# EAGLE design expander (EAGLE 7.2.0)
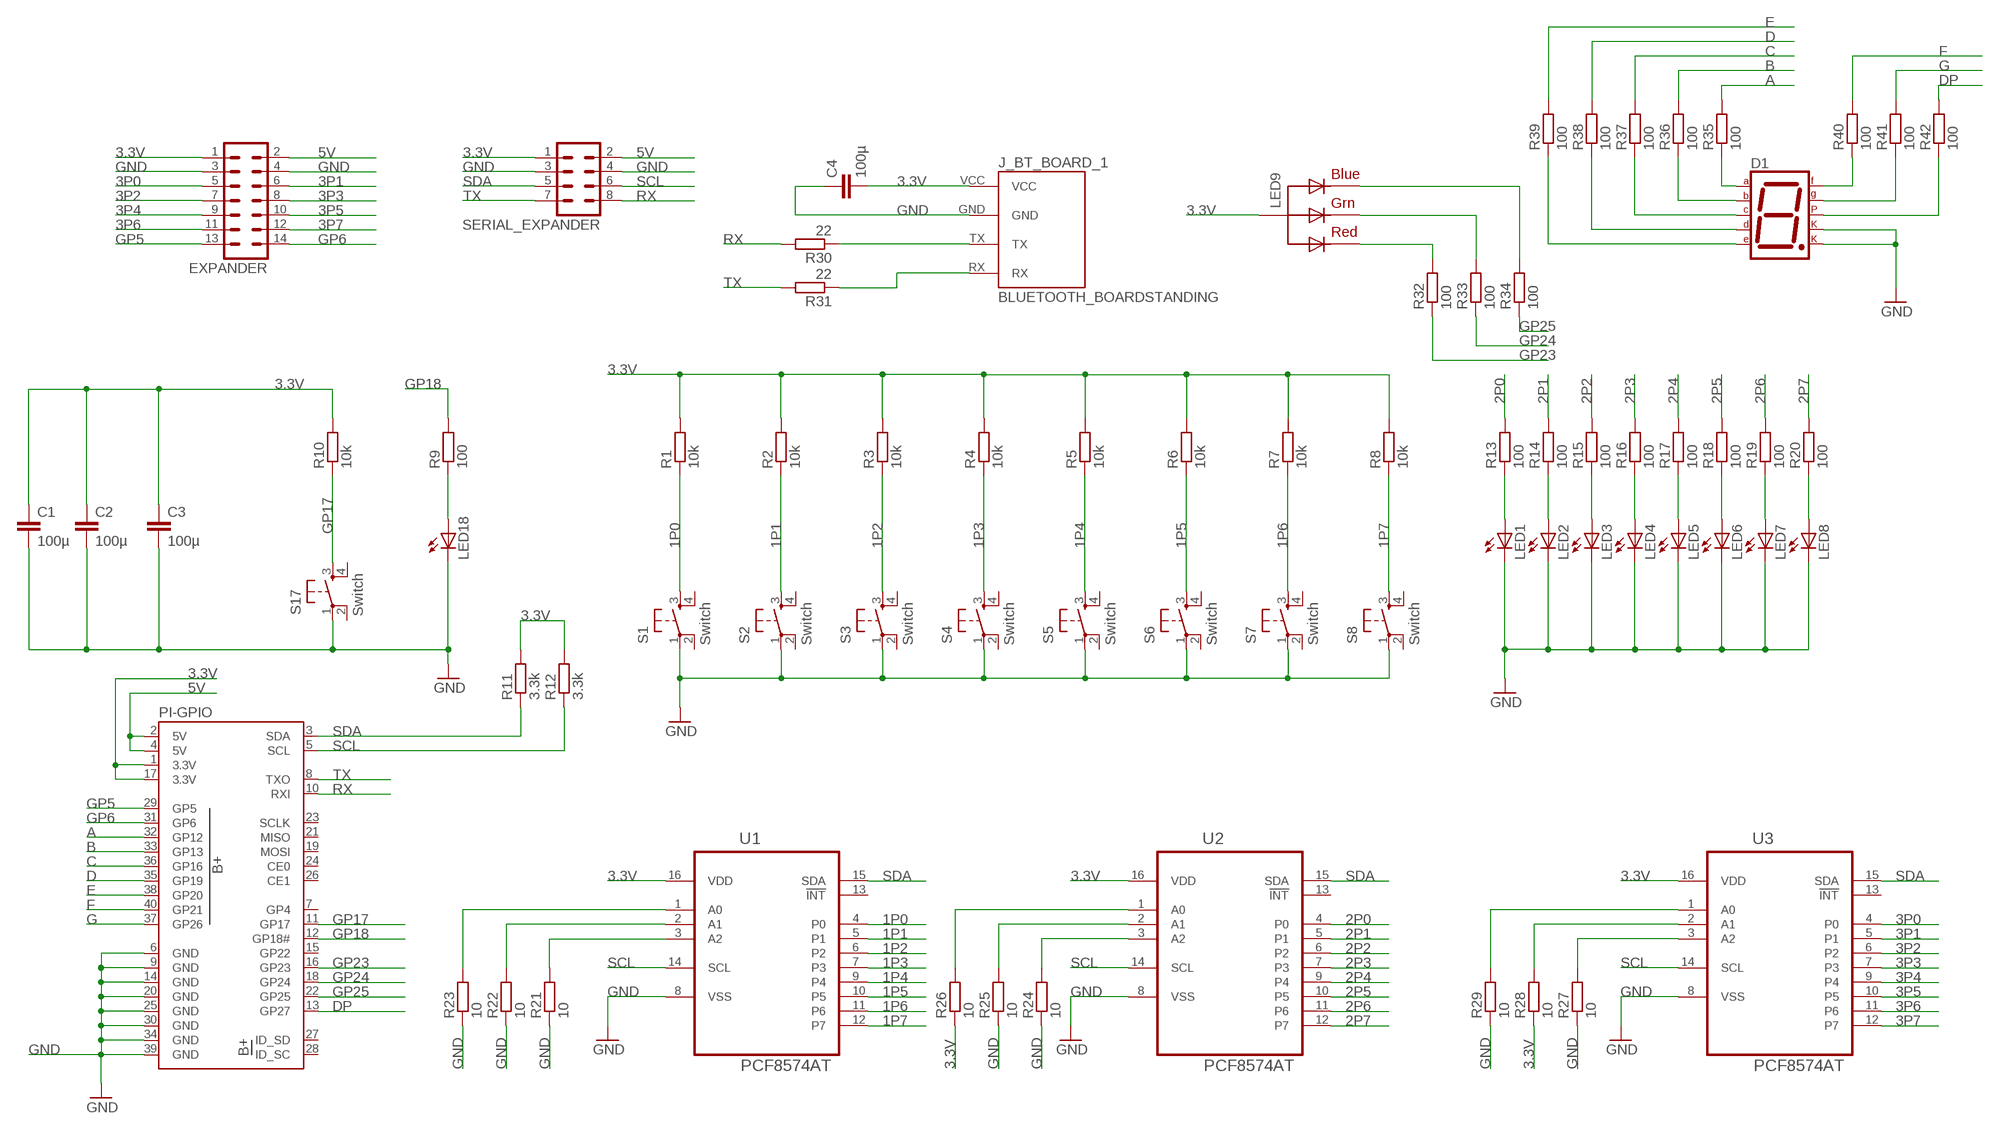
[diagram p0: schematic, sheet 1]

## Parts
C1  100µ  C-EUC0805  [C0805]
C2  100µ  C-EUC0805  [C0805]
C3  100µ  C-EUC0805  [C0805]
C4  100µ  C-EUC0805  [C0805]
D1  7SEG-CK  [7SEG-13]
EXPANDER  MA07-2  [MA07-2]
J_BT_BOARD_1  BLUETOOTH_BOARDSTANDING  [BT_BOARD_FOOTPRINT_STANDING]
LED1  LEDCHIP-LED0805  [CHIP-LED0805]
LED2  LEDCHIP-LED0805  [CHIP-LED0805]
LED3  LEDCHIP-LED0805  [CHIP-LED0805]
LED4  LEDCHIP-LED0805  [CHIP-LED0805]
LED5  LEDCHIP-LED0805  [CHIP-LED0805]
LED6  LEDCHIP-LED0805  [CHIP-LED0805]
LED7  LEDCHIP-LED0805  [CHIP-LED0805]
LED8  LEDCHIP-LED0805  [CHIP-LED0805]
LED9  RGBLED_CA-5MM  [LED5MMRGB]
LED18  LEDCHIP-LED0805  [CHIP-LED0805]
PI-GPIO  RASPBERRYPI-B+-GPIO  [2X20-SHROUDED]
R1  10k  R-EU_R0805  [R0805]
R2  10k  R-EU_R0805  [R0805]
R3  10k  R-EU_R0805  [R0805]
R4  10k  R-EU_R0805  [R0805]
R5  10k  R-EU_R0805  [R0805]
R6  10k  R-EU_R0805  [R0805]
R7  10k  R-EU_R0805  [R0805]
R8  10k  R-EU_R0805  [R0805]
R9  100  R-EU_R0805  [R0805]
R10  10k  R-EU_R0805  [R0805]
R11  3.3k  R-EU_R0805  [R0805]
R12  3.3k  R-EU_R0805  [R0805]
R13  100  R-EU_R0805  [R0805]
R14  100  R-EU_R0805  [R0805]
R15  100  R-EU_R0805  [R0805]
R16  100  R-EU_R0805  [R0805]
R17  100  R-EU_R0805  [R0805]
R18  100  R-EU_R0805  [R0805]
R19  100  R-EU_R0805  [R0805]
R20  100  R-EU_R0805  [R0805]
R21  10  R-EU_R0805  [R0805]
R22  10  R-EU_R0805  [R0805]
R23  10  R-EU_R0805  [R0805]
R24  10  R-EU_R0805  [R0805]
R25  10  R-EU_R0805  [R0805]
R26  10  R-EU_R0805  [R0805]
R27  10  R-EU_R0805  [R0805]
R28  10  R-EU_R0805  [R0805]
R29  10  R-EU_R0805  [R0805]
R30  22  R-EU_R0805  [R0805]
R31  22  R-EU_R0805  [R0805]
R32  100  R-EU_R0805  [R0805]
R33  100  R-EU_R0805  [R0805]
R34  100  R-EU_R0805  [R0805]
R35  100  R-EU_R0805  [R0805]
R36  100  R-EU_R0805  [R0805]
R37  100  R-EU_R0805  [R0805]
R38  100  R-EU_R0805  [R0805]
R39  100  R-EU_R0805  [R0805]
R40  100  R-EU_R0805  [R0805]
R41  100  R-EU_R0805  [R0805]
R42  100  R-EU_R0805  [R0805]
S1  Switch  TACTILE-SWITCH-PTH  [TAC-SWITCH-PTH]
S2  Switch  TACTILE-SWITCH-PTH  [TAC-SWITCH-PTH]
S3  Switch  TACTILE-SWITCH-PTH  [TAC-SWITCH-PTH]
S4  Switch  TACTILE-SWITCH-PTH  [TAC-SWITCH-PTH]
S5  Switch  TACTILE-SWITCH-PTH  [TAC-SWITCH-PTH]
S6  Switch  TACTILE-SWITCH-PTH  [TAC-SWITCH-PTH]
S7  Switch  TACTILE-SWITCH-PTH  [TAC-SWITCH-PTH]
S8  Switch  TACTILE-SWITCH-PTH  [TAC-SWITCH-PTH]
S17  Switch  TACTILE-SWITCH-PTH  [TAC-SWITCH-PTH]
SERIAL_EXPANDER  MA04-2  [MA04-2]
U1  PCF8574AT  PCF8574AT/3,512  [SOIC127P1032X265-16N]
U2  PCF8574AT  PCF8574AT/3,512  [SOIC127P1032X265-16N]
U3  PCF8574AT  PCF8574AT/3,512  [SOIC127P1032X265-16N]

## Nets
1P0: R1.1 S1.3 U1.4(P0)
1P1: R2.1 S2.3 U1.5(P1)
1P2: R3.1 S3.3 U1.6(P2)
1P3: R4.1 S4.3 U1.7(P3)
1P4: R5.1 S5.3 U1.9(P4)
1P5: R6.1 S6.3 U1.10(P5)
1P6: R7.1 S7.3 U1.11(P6)
1P7: R8.1 S8.3 U1.12(P7)
2P0: R13.2 U2.4(P0)
2P1: R14.2 U2.5(P1)
2P2: R15.2 U2.6(P2)
2P3: R16.2 U2.7(P3)
2P4: R17.2 U2.9(P4)
2P5: R18.2 U2.10(P5)
2P6: R19.2 U2.11(P6)
2P7: R20.2 U2.12(P7)
3.3V: C1.1 C2.1 C3.1 C4.2 EXPANDER.1 J_BT_BOARD_1.VCC LED9.2(VCC) PI-GPIO.1(3.3V) PI-GPIO.17(3.3V) R1.2 R2.2 R3.2 R4.2 R5.2 R6.2 R7.2 R8.2 R10.2 R11.2 R12.2 R26.1 R28.1 SERIAL_EXPANDER.1 U1.16(VDD) U2.16(VDD) U3.16(VDD)
3P0: EXPANDER.5 U3.4(P0)
3P1: EXPANDER.6 U3.5(P1)
3P2: EXPANDER.7 U3.6(P2)
3P3: EXPANDER.8 U3.7(P3)
3P4: EXPANDER.9 U3.9(P4)
3P5: EXPANDER.10 U3.10(P5)
3P6: EXPANDER.11 U3.11(P6)
3P7: EXPANDER.12 U3.12(P7)
5V: EXPANDER.2 PI-GPIO.2(5V) PI-GPIO.4(5V) SERIAL_EXPANDER.2
A: PI-GPIO.32(GP12) R35.2
B: PI-GPIO.33(GP13) R36.2
C: PI-GPIO.36(GP16) R37.2
D: PI-GPIO.35(GP19) R38.2
DP: PI-GPIO.13(GP27) R42.2
E: PI-GPIO.38(GP20) R39.2
F: PI-GPIO.40(GP21) R40.2
G: PI-GPIO.37(GP26) R41.2
GND: C1.2 C2.2 C3.2 C4.1 D1.3(CK1) D1.8(CK2) EXPANDER.3 EXPANDER.4 J_BT_BOARD_1.GND LED1.C LED2.C LED3.C LED4.C LED5.C LED6.C LED7.C LED8.C LED18.C PI-GPIO.6(GND) PI-GPIO.9(GND) PI-GPIO.14(GND) PI-GPIO.20(GND) PI-GPIO.25(GND) PI-GPIO.30(GND) PI-GPIO.34(GND) PI-GPIO.39(GND) R21.1 R22.1 R23.1 R24.1 R25.1 R27.1 R29.1 S1.1 S2.1 S3.1 S4.1 S5.1 S6.1 S7.1 S8.1 S17.1 SERIAL_EXPANDER.3 SERIAL_EXPANDER.4 U1.8(VSS) U2.8(VSS) U3.8(VSS)
GP5: EXPANDER.13 PI-GPIO.29(GP5)
GP6: EXPANDER.14 PI-GPIO.31(GP6)
GP17: PI-GPIO.11(GP17) R10.1 S17.3
GP18: PI-GPIO.12(GP18#) R9.2
GP23: PI-GPIO.16(GP23) R32.1
GP24: PI-GPIO.18(GP24) R33.1
GP25: PI-GPIO.22(GP25) R34.1
N$1: LED18.A R9.1
N$2: LED1.A R13.1
N$3: LED2.A R14.1
N$4: LED3.A R15.1
N$5: LED4.A R16.1
N$6: LED5.A R17.1
N$7: LED6.A R18.1
N$8: LED7.A R19.1
N$9: LED8.A R20.1
N$10: R21.2 U1.3(A2)
N$11: R22.2 U1.2(A1)
N$12: R23.2 U1.1(A0)
N$13: R24.2 U2.3(A2)
N$14: R25.2 U2.2(A1)
N$15: R26.2 U2.1(A0)
N$16: R27.2 U3.3(A2)
N$17: R28.2 U3.2(A1)
N$18: R29.2 U3.1(A0)
N$19: LED9.4(BLUE) R34.2
N$20: LED9.3(GREEN) R33.2
N$21: J_BT_BOARD_1.TX R30.1
N$22: J_BT_BOARD_1.RX R31.1
N$25: LED9.1(RED) R32.2
N$26: D1.7(A) R35.1
N$27: D1.6(B) R36.1
N$28: D1.4(C) R37.1
N$29: D1.2(D) R38.1
N$30: D1.1(E) R39.1
N$31: D1.9(F) R40.1
N$32: D1.10(G) R41.1
N$33: D1.5(DP) R42.1
RX: PI-GPIO.10(RXI) R30.2 SERIAL_EXPANDER.8
SCL: PI-GPIO.5(SCL) R12.1 SERIAL_EXPANDER.6 U1.14(SCL) U2.14(SCL) U3.14(SCL)
SDA: PI-GPIO.3(SDA) R11.1 SERIAL_EXPANDER.5 U1.15(SDA) U2.15(SDA) U3.15(SDA)
TX: PI-GPIO.8(TXO) R31.2 SERIAL_EXPANDER.7
Unconnected: PI-GPIO.7(GP4) PI-GPIO.15(GP22) PI-GPIO.19(MOSI) PI-GPIO.21(MISO) PI-GPIO.23(SCLK) PI-GPIO.24(CE0) PI-GPIO.26(CE1) PI-GPIO.27(ID_SD) PI-GPIO.28(ID_SC) S1.2 S1.4 S2.2 S2.4 S3.2 S3.4 S4.2 S4.4 S5.2 S5.4 S6.2 S6.4 S7.2 S7.4 S8.2 S8.4 S17.2 S17.4 U1.13(!INT) U2.13(!INT) U3.13(!INT)

## Library data of the parts
C1-C4 = rcl:C-EU: CAPACITOR, European symbol
D1 = special:7SEG-CK: 7-segment DISPLAY single cathode, 13 mm
EXPANDER = con-lstb:MA07-2: PIN HEADER; OC_FARNELL: unknown; OC_NEWARK: unknown
J_BT_BOARD_1 = Bluetooth HC-05:BLUETOOTH_BOARD: Bluetooth Board V1.05
LED1-LED8 LED18 = adafruit:LED: LED OSRAM: - CHIPLED LG R971, LG N971, LY N971, LG Q971, LY Q971, LO R971, LY R971 LH N974, LH R974 LS Q976, LO Q976, LY Q976 LO Q996 - Hyper CHIPLED LW Q18S LB Q993, LB Q99A, LB R99A - SideLED LS A670, LO A670, LY A670, LG A670, LP A670 LB A673, LV A673, LT A673, LW A673 LH A674 LY A675 LS A676, LA A676, LO A676, LY A676, LW A676 LS A679, LY A679, LG A679 - Hyper Micro SIDELED® LS Y876, LA Y876, LO Y876, LY Y876 LT Y87S - SmartLED LW L88C, LW L88S LB L89C, LB L89S, LG L890 LS L89K, LO L89K, LY L89K LS L896, LA L896, LO L896, LY L896 - TOPLED LS T670, LO T670, LY T670, LG T670, LP T670 LSG T670, LSP T670, LSY T670, LOP T670, LYG T670 LG T671, LOG T671, LSG T671 LB T673, LV T673, LT T673, LW T673 LH T674 LS T676, LA T676, LO T676, LY T676, LB T676, LH T676, LSB T676, LW T676 LB T67C, LV T67C, LT T67C, LS T67K, LO T67K, LY T67K, LW E67C LS E67B, LA E67B, LO E67B, LY E67B, LB E67C, LV E67C, LT E67C LW T67C LS T679, LY T679, LG T679 LS T770, LO T770, LY T770, LG T770, LP T770 LB T773, LV T773, LT T773, LW T773 LH T774 LS E675, LA E675, LY E675, LS T675 LS T776, LA T776, LO T776, LY T776, LB T776 LHGB T686 LT T68C, LB T68C - Hyper Mini TOPLED® LB M676 - Mini TOPLED Santana® LG M470 LS M47K, LO M47K, LY M47K Source: http://www.osram.convergy.de/
LED9 = adafruit:RGBLED_CA: RGB LED, common-anode 5MM Staggered pins 5mm Piranha package http://www.ladyada.net/library/pcb/eaglelibrary.html
PI-GPIO = SparkFun-Boards:RASPBERRYPI-B+-GPIO: Raspberry Pi B+ GPIO Header 2x20 pin connector
R1-R42 = resistor:R-EU_: RESISTOR, European symbol
S1-S8 S17 = GeekAmmo:TACTILE-SWITCH: Tactile Switch 4 Pins, SPST NO
SERIAL_EXPANDER = con-lstb:MA04-2: PIN HEADER; OC_FARNELL: unknown; OC_NEWARK: unknown
U1-U3 = IOexpanderIIC:PCF8574AT/3,512: IC, I/O EXPANDER, 8BIT, 16SOIC; MPN: PCF8574AT/3,512; OC_FARNELL: 2101302; OC_NEWARK: 70R6866; PACKAGE: SOIC-16; SUPPLIER: NXP

## Board
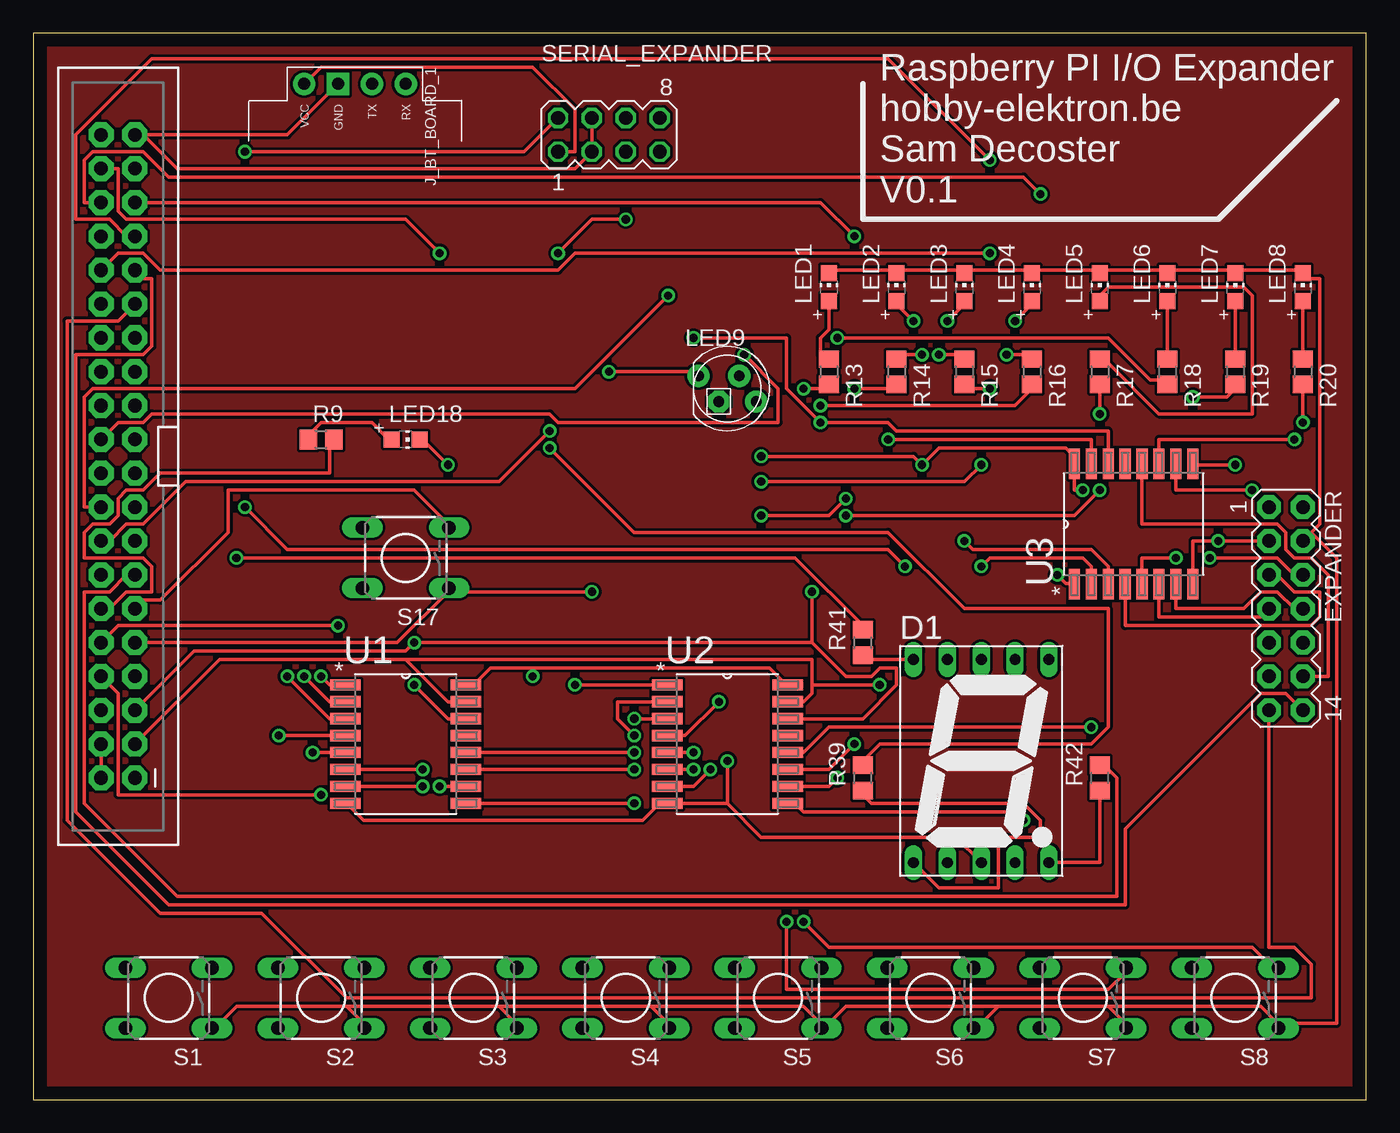
[diagram p1: board, top side]
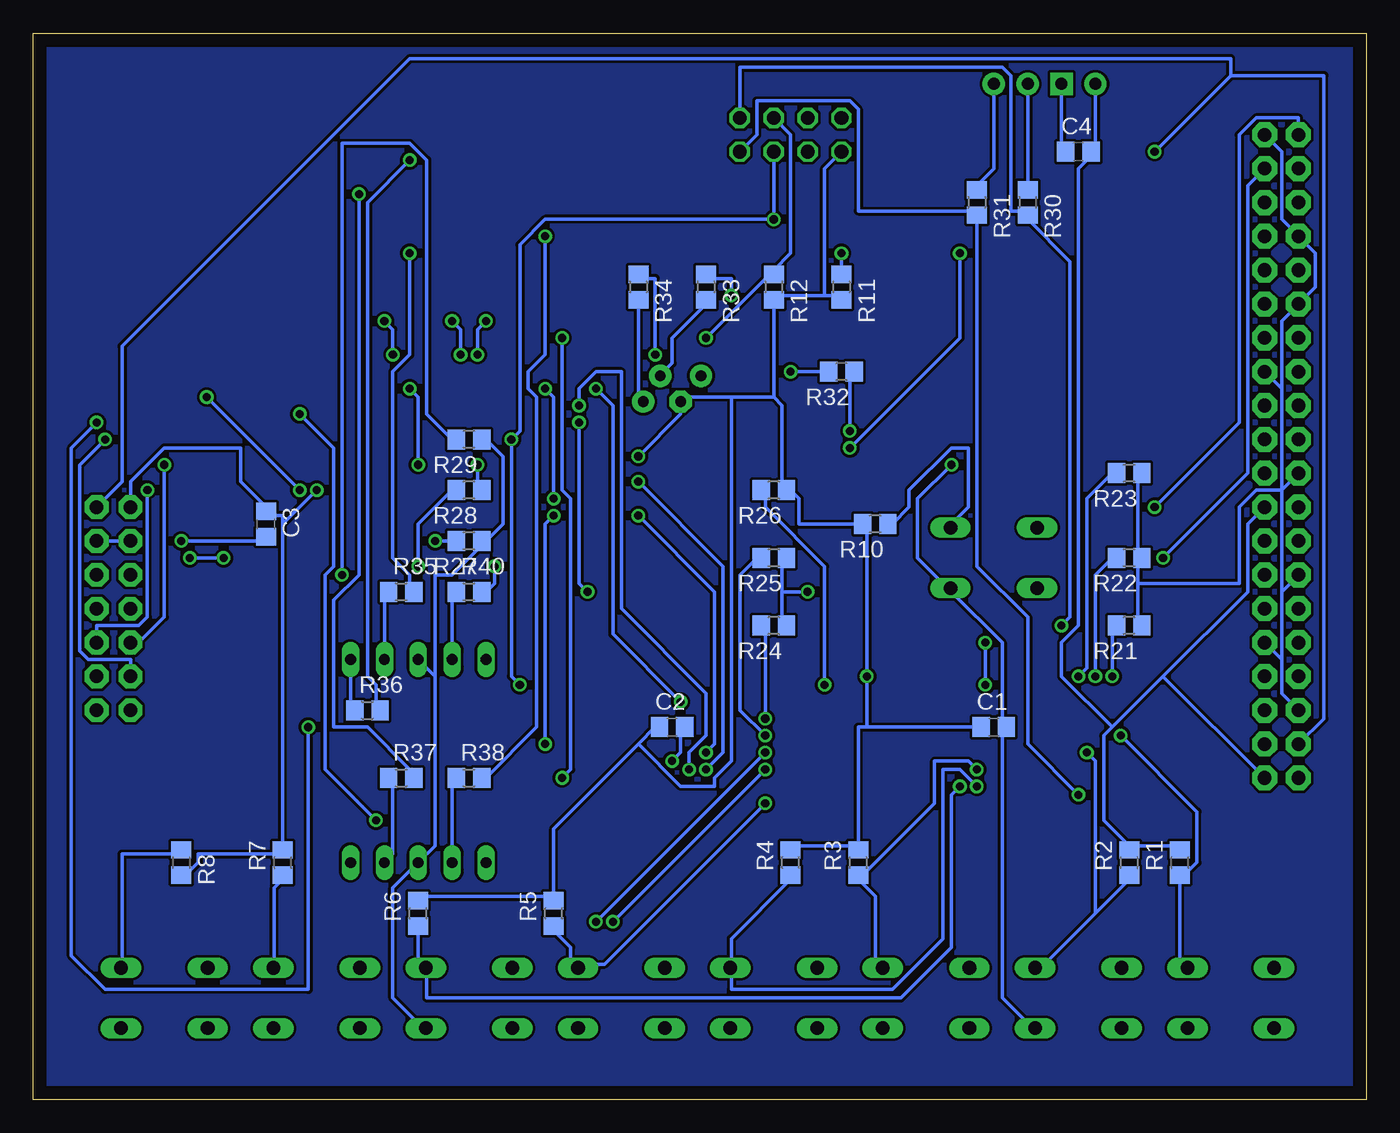
[diagram p2: board, bottom side, seen from below]

Size 100 x 80 mm. Coordinates in mm from the lower left corner, seen from the top.
Outline: 0,0 100,0 100,80 0,80 0,0
Copper layers (1*16): Top 0.035mm / dielectric 1.5mm / Bottom 0.035mm
Design rules "default": minimum track width 10mil, minimum drill 24mil, track to track 8mil, track to pad 8mil, pad to pad 8mil, via to via 8mil, smd to smd 8mil, copper to edge 40mil, drill to drill 8mil, minimum pad ring 10mil, minimum via ring 8mil, stop-mask expansion 4mil, vias tented up to drill 0mil, thermal gap 10mil

### Footprints (pad centres in the part's own frame; a part is rotated, then mirrored left to right if it is on the bottom)
C0805 = smd 1.3 x 1.5: 1 -0.95,0; 2 0.95,0
7SEG-13 = drill 0.813 long: 1 -5.08,-7.62; 2 -2.54,-7.62; 3 0,-7.62; 4 2.54,-7.62; 5 5.08,-7.62; 6 5.08,7.62; 7 2.54,7.62; 8 0,7.62; 9 -2.54,7.62; 10 -5.08,7.62
MA07-2 = drill 1.016 pad 1.778 octagon: 1 -7.62,-1.27; 2 -7.62,1.27; 3 -5.08,-1.27; 4 -5.08,1.27; 5 -2.54,-1.27; 6 -2.54,1.27; 7 0,-1.27; 8 0,1.27; 9 2.54,-1.27; 10 2.54,1.27; 11 5.08,-1.27; 12 5.08,1.27; 13 7.62,-1.27; 14 7.62,1.27
BT_BOARD_FOOTPRINT_STANDING = drill 0.9 pad 1.676 square: GND -3.81,-1.27 | drill 0.9 pad 1.676: RX -3.81,3.81; TX -3.81,1.27; VCC -3.81,-3.81
CHIP-LED0805 = smd 1.2 x 1.2: A 0,-1.05; C 0,1.05
LED5MMRGB = drill 0.8 pad 1.676: 1 -2.159,0.968; 3 0.889,0.968; 4 2.159,-0.968 | drill 0.8 pad 1.676 octagon: 2 -0.635,-0.968
2X20-SHROUDED = drill 1.016 pad 1.88 octagon: 1 -1.27,24.13; 2 1.27,24.13; 3 -1.27,21.59; 4 1.27,21.59; 5 -1.27,19.05; 6 1.27,19.05; 7 -1.27,16.51; 8 1.27,16.51; 9 -1.27,13.97; 10 1.27,13.97; 11 -1.27,11.43; 12 1.27,11.43; 13 -1.27,8.89; 14 1.27,8.89; 15 -1.27,6.35; 16 1.27,6.35; 17 -1.27,3.81; 18 1.27,3.81; 19 -1.27,1.27; 20 1.27,1.27; 21 -1.27,-1.27; 22 1.27,-1.27; 23 -1.27,-3.81; 24 1.27,-3.81; 25 -1.27,-6.35; 26 1.27,-6.35; 27 -1.27,-8.89; 28 1.27,-8.89; 29 -1.27,-11.43; 30 1.27,-11.43; 31 -1.27,-13.97; 32 1.27,-13.97; 33 -1.27,-16.51; 34 1.27,-16.51; 35 -1.27,-19.05; 36 1.27,-19.05; 37 -1.27,-21.59; 38 1.27,-21.59; 39 -1.27,-24.13; 40 1.27,-24.13
R0805 = smd 1.3 x 1.5: 1 -0.95,0; 2 0.95,0
TAC-SWITCH-PTH = drill 1.016 pad 1.524 long: 1 -3.251,2.261; 2 3.251,2.261; 3 -3.251,-2.261; 4 3.251,-2.261
MA04-2 = drill 1.016 octagon: 1 -3.81,-1.27; 2 -3.81,1.27; 3 -1.27,-1.27; 4 -1.27,1.27; 5 1.27,-1.27; 6 1.27,1.27; 7 3.81,-1.27; 8 3.81,1.27
SOIC127P1032X265-16N = smd 2.286 x 0.838: 1 -4.521,4.445; 2 -4.521,3.175; 3 -4.521,1.905; 4 -4.521,0.635; 5 -4.521,-0.635; 6 -4.521,-1.905; 7 -4.521,-3.175; 8 -4.521,-4.445; 9 4.521,-4.445; 10 4.521,-3.175; 11 4.521,-1.905; 12 4.521,-0.635; 13 4.521,0.635; 14 4.521,1.905; 15 4.521,3.175; 16 4.521,4.445

### Placement (x,y rotation side)
C1  27.94,27.94 0 bottom
C2  52.07,27.94 0 bottom
C3  82.55,43.18 270 bottom
C4  21.59,71.12 0 bottom
D1  71.12,25.4 0 top
EXPANDER  93.98,36.83 270 top
J_BT_BOARD_1  24.13,72.39 270 top
LED1  59.69,60.96 0 top
LED2  64.77,60.96 0 top
LED3  69.85,60.96 0 top
LED4  74.93,60.96 0 top
LED5  80.01,60.96 0 top
LED6  85.09,60.96 0 top
LED7  90.17,60.96 0 top
LED8  95.25,60.96 0 top
LED9  52.07,53.34 0 top
LED18  27.94,49.53 270 top
PI-GPIO  6.35,48.26 180 top
R1  13.97,17.78 90 bottom
R2  17.78,17.78 90 bottom
R3  38.1,17.78 90 bottom
R4  43.18,17.78 90 bottom
R5  60.96,13.97 90 bottom
R6  71.12,13.97 90 bottom
R7  81.28,17.78 90 bottom
R8  88.9,17.78 270 bottom
R9  21.59,49.53 0 top
R10  36.83,43.18 180 bottom
R11  39.37,60.96 270 bottom
R12  44.45,60.96 270 bottom
R13  59.69,54.61 270 top
R14  64.77,54.61 270 top
R15  69.85,54.61 270 top
R16  74.93,54.61 270 top
R17  80.01,54.61 270 top
R18  85.09,54.61 270 top
R19  90.17,54.61 270 top
R20  95.25,54.61 270 top
R21  17.78,35.56 180 bottom
R22  17.78,40.64 180 bottom
R23  17.78,46.99 180 bottom
R24  44.45,35.56 180 bottom
R25  44.45,40.64 180 bottom
R26  44.45,45.72 180 bottom
R27  67.31,41.91 180 bottom
R28  67.31,45.72 180 bottom
R29  67.31,49.53 180 bottom
R30  25.4,67.31 270 bottom
R31  29.21,67.31 270 bottom
R32  39.37,54.61 180 bottom
R33  49.53,60.96 270 bottom
R34  54.61,60.96 270 bottom
R35  72.39,38.1 0 bottom
R36  74.93,29.21 0 bottom
R37  72.39,24.13 0 bottom
R38  67.31,24.13 0 bottom
R39  62.23,24.13 90 top
R40  67.31,38.1 0 bottom
R41  62.23,34.29 90 top
R42  80.01,24.13 90 top
S1  10.16,7.62 180 top
S2  21.59,7.62 180 top
S3  33.02,7.62 180 top
S4  44.45,7.62 180 top
S5  55.88,7.62 180 top
S6  67.31,7.62 180 top
S7  78.74,7.62 180 top
S8  90.17,7.62 180 top
S17  27.94,40.64 180 top
SERIAL_EXPANDER  43.18,72.39 0 top
U1  27.94,26.67 0 top
U2  52.07,26.67 0 top
U3  82.55,43.18 90 top

### Tracks (layer width: path | path; a pad name or v marks a point on that pad's centre or on a via)
1P0  (via drill 0.61)
  Top 0.254: v18.41,27.3 U1.4
  Bottom 0.254: 13.97,16.51 13.97,10.16 S1.3 | v18.41,27.3 12.7,21.59 12.7,17.78 13.97,16.51 | 13.97,16.51 R1.1
1P1  (via drill 0.61)
  Top 0.254: v20.95,26.04 U1.5
  Bottom 0.254: 20.32,13.97 24.77,9.53 S2.3 | 20.32,13.97 17.78,16.51 R2.1 | v20.95,26.04 20.32,25.4 20.32,13.97
1P2  (via drill 0.61)
  Top 0.254: v29.21,24.77 U1.6
  Bottom 0.254: 38.1,16.51 36.83,15.24 36.83,10.16 S3.3 | v29.21,24.77 29.84,25.4 32.38,25.4 32.38,22.23 38.1,16.51 | 38.1,16.51 R3.1
1P3  (via drill 0.61)
  Top 0.254: v29.21,23.5 U1.7
  Bottom 0.254: R4.1 43.18,16.51 47.62,12.06 47.62,10.16 S4.3 47.62,9.53 47.62,8.26 35.56,8.26 31.75,12.06 31.75,24.77 30.48,24.77 v29.21,23.5
1P4  (via drill 0.61)
  Top 0.254: v45.09,22.23 U1.9
  Bottom 0.254: R5.1 60.96,12.7 59.69,11.43 59.69,10.16 S5.3 59.05,10.16 57.15,10.16 v45.09,22.23
1P5  (via drill 0.61)
  Top 0.254: v30.48,23.5 U1.10
  Bottom 0.254: R6.1 71.12,10.16 S6.3 70.48,9.53 70.48,7.62 34.92,7.62 31.11,11.43 31.11,22.86 v30.48,23.5
1P6  (via drill 0.61)
  Top 0.254: v45.09,24.77 U1.11 | v56.52,13.34 56.52,8.26 80.64,8.26 81.92,9.53 S7.3
  Bottom 0.254: R7.1 81.28,16.51 81.92,15.88 81.92,10.16 S7.3 | v56.52,13.34 v45.09,24.77
1P7  (via drill 0.61)
  Top 0.254: v45.09,26.04 U1.12 | v57.78,13.34 59.69,11.43 91.44,11.43 92.71,10.16 93.34,10.16 S8.3
  Bottom 0.254: R8.1 88.9,18.41 93.34,18.41 93.34,10.16 S8.3 | v57.78,13.34 v45.09,26.04
2P0  (via drill 0.61)
  Top 0.254: v57.78,53.34 59.69,53.34 R13.2 | v51.44,29.84 48.9,27.3 U2.4
  Bottom 0.254: v57.78,53.34 56.52,52.07 56.52,34.92 v51.44,29.84
2P1  (via drill 0.61)
  Top 0.254: v61.59,53.34 64.77,53.34 R14.2 | v60.96,45.09 59.69,43.81 v54.61,43.81 | U2.5 v49.53,26.04
  Bottom 0.254: v61.59,53.34 60.96,52.7 v60.96,45.09 | v54.61,43.81 48.9,38.1 48.9,26.67 v49.53,26.04
2P2  (via drill 0.61)
  Top 0.254: v71.75,53.34 69.85,53.34 R15.2 | v71.12,47.62 69.85,46.35 v54.61,46.35 | U2.6 v49.53,24.77
  Bottom 0.254: v71.75,53.34 71.12,52.7 v71.12,47.62 | v54.61,46.35 48.26,40.01 48.26,26.04 v49.53,24.77
2P3  (via drill 0.61)
  Top 0.254: v59.05,52.07 73.66,52.07 74.93,53.34 R16.2 | v50.8,24.77 49.53,23.5 U2.7
  Bottom 0.254: v59.05,52.07 59.05,53.34 57.78,54.61 55.88,54.61 55.88,36.83 49.53,30.48 49.53,27.3 50.8,26.04 v50.8,24.77
2P4  (via drill 0.61)
  Top 0.254: v80.01,51.44 R17.2 | v74.3,20.95 73.66,21.59 57.78,21.59 57.15,22.23 U2.9
  Bottom 0.254: v80.01,51.44 77.47,48.9 77.47,40.01 78.11,39.37 78.11,24.77 v74.3,20.95
2P5  (via drill 0.61)
  Top 0.254: v60.33,57.15 80.64,57.15 83.82,53.98 85.09,53.98 R18.2 | v60.33,24.13 59.69,23.5 U2.10
  Bottom 0.254: v60.33,57.15 60.33,45.72 59.69,45.09 59.69,24.77 v60.33,24.13
2P6  (via drill 0.61)
  Top 0.254: v87,52.7 89.53,52.7 90.17,53.34 R19.2 | v80.01,45.72 78.11,43.81 v60.96,43.81 | v61.59,26.67 59.69,24.77 U2.11
  Bottom 0.254: v80.01,45.72 v87,52.7 | v60.96,43.81 61.59,43.18 v61.59,26.67
2P7  (via drill 0.61)
  Top 0.254: v95.25,50.8 R20.2 | v79.38,27.94 59.69,27.94 57.78,26.04 U2.12
  Bottom 0.254: v95.25,50.8 97.16,48.9 97.16,10.79 94.61,8.26 79.38,8.26 v79.38,27.94
3.3V  (via drill 0.61)
  Top 0.254: v78.74,45.72 78.11,45.72 U3.16 78.11,48.26 77.47,48.9 67.94,48.9 v66.67,47.62 66.04,48.26 v54.61,48.26 | 37.47,32.38 55.24,32.38 56.52,31.11 U2.16 | 37.47,32.38 34.29,32.38 33.02,31.11 U1.16 | J_BT_BOARD_1.VCC 21.59,77.47 37.47,77.47 40.64,74.3 40.64,71.12 SERIAL_EXPANDER.1 | v37.47,31.75 37.47,32.38
  Bottom 0.254: v66.67,47.62 66.67,45.72 R28.1 | R8.2 88.9,16.51 87.63,17.78 87.63,18.41 81.28,18.41 R7.2 81.28,43.18 | 81.28,43.18 81.28,43.81 82.55,43.81 C3.1 82.55,44.45 84.45,46.35 84.45,48.9 90.17,48.9 92.71,46.35 EXPANDER.1 | 81.28,43.18 v78.74,45.72 | 17.78,19.05 13.97,19.05 R1.2 | 17.78,19.05 19.68,20.95 19.68,27.3 19.05,27.94 | 15.24,31.75 8.89,38.1 8.89,43.18 PI-GPIO.17 | 15.24,31.75 19.05,27.94 | 17.78,19.05 R2.2 | 15.24,31.75 PI-GPIO.1 | 60.96,15.24 71.12,15.24 R6.2 | 54.61,26.67 60.96,20.32 60.96,15.24 | 54.61,26.67 53.34,27.94 C2.1 | 60.96,15.24 R5.2 | 37.47,27.94 38.1,27.94 38.1,19.05 | 37.47,27.94 C1.1 | 38.1,19.05 43.18,19.05 R4.2 | 38.1,19.05 R3.2 | J_BT_BOARD_1.VCC 20.32,71.12 C4.2 20.95,71.12 20.95,70.48 21.59,69.85 21.59,35.56 22.86,34.29 22.86,31.75 19.05,27.94 | 40.64,60.33 44.45,60.33 R12.2 44.45,52.7 | 40.64,60.33 39.37,60.33 R11.2 | SERIAL_EXPANDER.1 40.64,69.85 40.64,60.33 | 44.45,52.7 47.62,52.7 | 47.62,52.7 51.44,52.7 LED9.2 51.44,51.44 v54.61,48.26 | 44.45,52.7 43.81,52.07 43.81,45.72 R26.1 43.18,45.72 42.55,45.09 42.55,43.18 R10.2 37.47,43.18 v37.47,31.75 37.47,27.94 | 54.61,26.67 51.44,23.5 48.9,23.5 48.9,24.13 47.62,25.4 47.62,52.7
3P0
  Top 0.254: U3.4 81.92,35.56 95.89,35.56 96.52,36.2 96.52,38.1 94.61,38.1 93.34,39.37 EXPANDER.5
3P1  (via drill 0.61)
  Top 0.254: U3.5 83.19,40.64 v85.72,40.64 | v88.27,40.64 93.34,40.64 94.61,39.37 EXPANDER.6
  Bottom 0.254: v88.27,40.64 v85.72,40.64
3P2
  Top 0.254: U3.6 84.45,36.2 92.08,36.2 EXPANDER.7
3P3
  Top 0.254: U3.7 85.72,36.83 90.81,36.83 92.08,38.1 93.34,38.1 94.61,36.83 EXPANDER.8
3P4  (via drill 0.61)
  Top 0.254: v90.17,47.62 87,47.62 U3.9
  Bottom 0.254: v90.17,47.62 90.17,36.2 92.08,34.29 EXPANDER.9
3P5  (via drill 0.61)
  Top 0.254: U3.10 85.72,45.72 v91.44,45.72
  Bottom 0.254: v91.44,45.72 91.44,36.2 92.08,35.56 95.25,35.56 EXPANDER.10
3P6  (via drill 0.61)
  Top 0.254: U3.11 84.45,49.53 v94.61,49.53
  Bottom 0.254: v94.61,49.53 96.52,47.62 96.52,33.66 95.89,33.02 92.71,33.02 EXPANDER.11
3P7
  Top 0.254: U3.12 83.19,43.18 93.34,43.18 93.98,42.55 93.98,41.27 94.61,40.64 95.89,40.64 97.16,39.37 97.16,31.75 EXPANDER.12
5V  (via drill 0.61)
  Top 0.254: SERIAL_EXPANDER.2 36.83,71.12 v15.88,71.12 | PI-GPIO.4 PI-GPIO.2
  Bottom 0.254: 10.16,76.83 v15.88,71.12 | 10.16,76.83 3.17,76.83 3.17,28.57 PI-GPIO.4 | EXPANDER.2 93.34,46.35 93.34,56.52 71.75,78.11 10.16,78.11 10.16,76.83
A  (via drill 0.61)
  Top 0.254: v71.75,63.5 40.64,63.5 39.37,62.23 9.53,62.23 8.26,63.5 6.35,63.5 PI-GPIO.32
  Bottom 0.254: v71.75,63.5 71.75,55.88 73.03,54.61 73.03,40.64 71.75,39.37 71.75,38.1 R35.2
B  (via drill 0.61)
  Top 0.254: v71.75,70.48 64.14,78.11 8.89,78.11 3.17,72.39 3.17,66.04 5.71,66.04 6.99,64.77 PI-GPIO.33
  Bottom 0.254: v71.75,70.48 74.93,67.31 74.93,31.75 74.3,31.11 74.3,29.21 R36.2
C  (via drill 0.61)
  Top 0.254: v75.56,67.94 74.3,69.22 10.16,69.22 8.26,71.12 4.45,71.12 3.81,70.48 3.81,67.31 PI-GPIO.36
  Bottom 0.254: v75.56,67.94 75.56,39.37 77.47,37.47 77.47,27.94 74.93,27.94 71.75,24.77 71.75,24.13 R37.2
D  (via drill 0.61)
  Top 0.254: v61.59,64.77 59.05,67.31 PI-GPIO.35
  Bottom 0.254: v61.59,64.77 61.59,55.88 62.87,54.61 62.87,53.34 62.23,52.7 62.23,27.94 66.04,24.13 R38.2
DP
  Top 0.254: PI-GPIO.13 6.99,39.37 5.71,38.1 3.81,38.1 3.81,22.23 10.79,15.24 81.28,15.24 81.28,24.13 80.64,24.77 80.01,24.77 R42.2
E  (via drill 0.61)
  Top 0.254: v38.73,48.9 45.09,42.55 64.14,42.55 69.85,36.83 80.64,36.83 80.64,27.94 79.38,26.67 63.5,26.67 62.23,25.4 R39.2 | v30.48,63.5 27.94,66.04 6.99,66.04 6.35,66.67 6.35,69.85 PI-GPIO.38
  Bottom 0.254: v38.73,48.9 30.48,57.15 v30.48,63.5
F  (via drill 0.61)
  Top 0.254: v65.41,40.01 64.14,41.27 19.05,41.27 v15.88,44.45
  Bottom 0.254: v65.41,40.01 65.41,38.73 66.04,38.1 R40.2 | v15.88,44.45 9.53,50.8 9.53,72.39 8.26,73.66 5.08,73.66 PI-GPIO.40
G  (via drill 0.61)
  Top 0.254: v15.24,40.64 57.15,40.64 62.23,35.56 R41.2
  Bottom 0.254: v15.24,40.64 8.89,46.99 8.89,68.58 PI-GPIO.37
GND  (via drill 0.61)
  Top 0.254: SERIAL_EXPANDER.4 SERIAL_EXPANDER.3 40.64,69.85 10.79,69.85 8.26,72.39 | J_BT_BOARD_1.GND 19.05,72.39 8.26,72.39 | 8.26,72.39 PI-GPIO.39 | v31.11,47.62 29.21,49.53 LED18.C | v41.91,38.1 31.75,38.1 S17.1 31.11,38.1 27.3,34.29 PI-GPIO.9 | EXPANDER.3 v88.9,41.91 87,41.91 U3.8 | 64.77,62.23 59.69,62.23 LED1.C | 64.77,62.23 69.85,62.23 | 64.77,62.23 LED2.C | 69.85,62.23 74.93,62.23 | 69.85,62.23 LED3.C | 74.93,62.23 80.01,62.23 | 74.93,62.23 LED4.C | 80.01,62.23 85.09,62.23 | 80.01,62.23 LED5.C | 85.09,62.23 90.17,62.23 | 85.09,62.23 LED6.C | 90.17,62.23 95.25,62.23 LED8.C 95.25,61.59 96.52,61.59 96.52,43.18 95.89,42.55 | 90.17,62.23 LED7.C | 95.89,42.55 EXPANDER.4 | 23.5,6.99 15.24,6.99 13.97,5.71 S1.1 | 23.5,6.99 24.77,5.71 S2.1 | 34.92,6.99 36.2,5.71 S3.1 | 23.5,6.99 34.92,6.99 | 46.35,6.99 47.62,5.71 S4.1 | 34.92,6.99 46.35,6.99 | 46.35,6.99 57.78,6.99 59.05,5.71 S5.1 59.69,5.71 60.96,6.99 72.39,6.99 | 52.07,22.23 v52.07,25.4 | 52.07,22.23 U2.8 46.99,22.23 45.72,20.95 24.77,20.95 23.5,22.23 U1.8 | 80.64,6.99 81.92,5.71 S7.1 | 72.39,6.99 80.64,6.99 | 72.39,6.99 71.12,5.71 S6.1 | 80.64,6.99 92.08,6.99 93.34,5.71 S8.1 93.98,5.71 97.79,5.71 97.79,40.64 95.89,42.55 | 52.07,22.23 54.61,19.68 69.22,19.68 D1.3
  Bottom 0.254: J_BT_BOARD_1.GND 22.86,71.12 C4.1 | PI-GPIO.39 6.35,71.12 6.35,66.04 PI-GPIO.34 3.81,63.5 3.81,60.96 PI-GPIO.30 6.35,58.42 6.35,53.34 | 43.81,38.1 43.81,40.64 R25.1 | 43.81,38.1 43.81,35.56 R24.1 | v31.11,47.62 33.66,45.09 33.66,40.64 31.75,38.73 S17.1 31.11,38.1 27.3,34.29 27.3,27.94 | v41.91,38.1 43.81,38.1 | 17.14,40.64 17.14,38.73 | 17.14,38.73 17.14,35.56 R21.1 | 17.14,40.64 17.14,46.99 R23.1 | 17.14,40.64 R22.1 | PI-GPIO.6 6.35,30.48 6.35,33.02 | PI-GPIO.9 6.35,33.02 | 6.35,38.1 PI-GPIO.14 | 6.35,33.02 6.35,38.1 | 6.35,45.72 PI-GPIO.20 | 6.35,38.1 6.35,45.72 | 6.35,53.34 PI-GPIO.25 | 6.35,45.72 6.35,53.34 | 17.14,38.73 9.53,38.73 9.53,44.45 8.26,45.72 6.35,45.72 | v88.9,41.91 82.55,41.91 C3.2 | EXPANDER.3 EXPANDER.4 | v52.07,25.4 51.44,26.04 51.44,27.94 C2.2 | R29.1 66.04,49.53 64.77,48.26 64.77,43.18 66.04,41.91 R27.1 66.67,41.91 66.67,41.27 68.58,39.37 69.85,39.37 69.85,31.75 | S6.1 71.12,5.71 73.03,7.62 73.03,15.88 D1.3 69.85,19.05 69.85,31.75 | 69.85,31.75 D1.8 | 27.3,27.94 27.3,7.62 25.4,5.71 S2.1 | 27.3,27.94 C1.2
GP5
  Top 0.254: EXPANDER.13 92.71,11.43 94.61,11.43 95.89,10.16 95.89,7.62 23.5,7.62 17.14,13.97 9.53,13.97 2.54,20.95 2.54,58.42 6.35,58.42 PI-GPIO.29
GP6
  Top 0.254: EXPANDER.14 93.98,30.48 92.08,30.48 81.92,20.32 81.92,14.61 10.16,14.61 3.17,21.59 3.17,55.88 8.26,55.88 8.89,56.52 8.89,61.59 8.26,61.59 PI-GPIO.31
GP17
  Top 0.254: PI-GPIO.11 8.26,37.47 9.53,37.47 14.61,42.55 14.61,45.72 28.57,45.72 31.11,43.18 S17.3
  Bottom 0.254: R10.1 35.56,43.18 34.29,44.45 34.29,45.72 31.11,48.9 29.84,48.9 29.84,44.45 31.11,43.18 S17.3
GP18
  Top 0.254: PI-GPIO.12 5.71,36.83 6.99,38.1 8.89,38.1 8.89,40.01 8.26,40.64 3.81,40.64 3.81,42.55 4.45,43.18 5.71,43.18 6.35,43.81 6.35,45.09 6.99,45.72 8.26,45.72 9.53,46.99 22.23,46.99 22.23,49.53 R9.2
GP23  (via drill 0.61)
  Top 0.254: v38.73,50.16 34.92,46.35 11.43,46.35 8.26,43.18 6.99,43.18 5.71,41.91 PI-GPIO.16
  Bottom 0.254: v38.73,50.16 38.73,54.61 R32.1
GP24  (via drill 0.61)
  Top 0.254: v47.62,60.33 40.64,53.34 4.45,53.34 3.81,52.7 3.81,44.45 PI-GPIO.18
  Bottom 0.254: v47.62,60.33 47.62,61.59 49.53,61.59 R33.1
GP25  (via drill 0.61)
  Top 0.254: v53.34,55.88 55.88,53.34 55.88,50.8 39.37,50.8 38.73,51.44 8.89,51.44 8.26,50.8 6.35,50.8 PI-GPIO.22
  Bottom 0.254: v53.34,55.88 53.34,61.59 54.61,61.59 R34.1
N$1
  Top 0.254: LED18.A 26.67,49.53 25.4,50.8 21.59,50.8 20.32,49.53 R9.1
N$2
  Top 0.254: LED1.A 59.69,57.78 59.05,57.15 59.05,55.88 59.69,55.88 R13.1
N$3  (via drill 0.61)
  Top 0.254: v66.04,58.42 64.77,59.69 LED2.A | v66.67,55.88 64.77,55.88 R14.1
  Bottom 0.254: v66.04,58.42 66.67,57.78 v66.67,55.88
N$4  (via drill 0.61)
  Top 0.254: v68.58,58.42 69.85,59.69 LED3.A | v67.94,55.88 69.85,55.88 R15.1
  Bottom 0.254: v68.58,58.42 67.94,57.78 v67.94,55.88
N$5  (via drill 0.61)
  Top 0.254: v73.66,58.42 74.93,59.69 LED4.A | v73.03,55.88 74.93,55.88 R16.1
  Bottom 0.254: v73.66,58.42 73.03,57.78 v73.03,55.88
N$6
  Top 0.254: LED5.A 80.01,60.33 80.64,60.96 90.81,60.96 91.44,60.33 91.44,51.44 84.45,51.44 80.64,55.24 80.01,55.24 R17.1
N$7
  Top 0.254: R18.1 LED6.A
N$8
  Top 0.254: R19.1 LED7.A
N$9
  Top 0.254: R20.1 LED8.A
N$10  (via drill 0.61)
  Top 0.254: v19.05,31.75 22.23,28.57 U1.3
  Bottom 0.254: v19.05,31.75 19.05,35.56 R21.2
N$11  (via drill 0.61)
  Top 0.254: v20.32,31.75 22.23,29.84 U1.2
  Bottom 0.254: v20.32,31.75 20.32,39.37 19.05,40.64 R22.2
N$12  (via drill 0.61)
  Top 0.254: v21.59,31.75 22.23,31.11 U1.1
  Bottom 0.254: v21.59,31.75 20.95,32.38 20.95,45.09 19.05,46.99 R23.2
N$13  (via drill 0.61)
  Top 0.254: U2.3 v45.09,28.57
  Bottom 0.254: v45.09,28.57 45.09,35.56 R24.2
N$14  (via drill 0.61)
  Top 0.254: v45.09,27.3 43.81,28.57 43.81,29.84 U2.2
  Bottom 0.254: v45.09,27.3 46.99,29.21 46.99,39.37 45.72,40.64 R25.2
N$15  (via drill 0.61)
  Top 0.254: U2.1 v40.64,31.11
  Bottom 0.254: v40.64,31.11 40.64,40.01 45.09,44.45 45.09,45.72 R26.2
N$16  (via drill 0.61)
  Top 0.254: v69.85,41.91 70.48,41.27 79.38,41.27 80.64,40.01 U3.3
  Bottom 0.254: v69.85,41.91 R27.2
N$17  (via drill 0.61)
  Top 0.254: v71.12,40.01 71.75,40.64 78.74,40.64 79.38,40.01 U3.2
  Bottom 0.254: v71.12,40.01 71.12,43.18 68.58,45.72 R28.2
N$18  (via drill 0.61)
  Top 0.254: v76.83,39.37 77.47,38.73 78.11,38.73 U3.1
  Bottom 0.254: v76.83,39.37 76.83,71.75 71.75,71.75 70.48,70.48 70.48,51.44 68.58,49.53 R29.2
N$19
  Bottom 0.254: R34.2 54.61,52.7 LED9.4
N$20
  Bottom 0.254: R33.2 49.53,59.69 52.07,57.15 52.07,55.24 52.7,54.61 LED9.3
N$21
  Bottom 0.254: J_BT_BOARD_1.TX R30.1
N$22
  Bottom 0.254: J_BT_BOARD_1.RX 27.94,69.85 29.21,68.58 R31.1
N$23
  pour Top: 0,0 0,80.01 100.33,80.01 100.33,0
N$24
  pour Bottom: 0,0 0,80.01 100.33,80.01 100.33,0
N$25  (via drill 0.61)
  Top 0.254: v43.18,54.61 49.53,54.61 LED9.1
  Bottom 0.254: v43.18,54.61 R32.2
N$26
  Bottom 0.254: D1.7 73.66,38.1 R35.1
N$27
  Bottom 0.254: D1.6 76.2,29.21 R36.1
N$28
  Bottom 0.254: D1.4 73.03,18.41 73.03,24.13 R37.1
N$29
  Bottom 0.254: D1.2 68.58,24.13 R38.1
N$30
  Top 0.254: D1.1 67.94,15.88 72.39,15.88 72.39,19.05 73.03,19.68 75.56,19.68 75.56,20.95 74.3,22.23 62.87,22.23 62.23,22.86 R39.1
N$31
  Bottom 0.254: D1.9 68.58,38.1 R40.1
N$32
  Top 0.254: D1.10 62.23,33.02 R41.1
N$33
  Top 0.254: R42.1 80.01,17.78 D1.5
RX  (via drill 0.61)
  Top 0.254: PI-GPIO.10 6.35,35.56 v22.86,35.56
  Bottom 0.254: SERIAL_EXPANDER.8 46.99,77.47 27.3,77.47 26.67,76.83 26.67,66.67 25.4,66.67 R30.2 25.4,66.04 22.23,62.87 22.23,36.2 v22.86,35.56
SCL  (via drill 0.61)
  Top 0.254: U1.14 31.11,28.57 v28.57,31.11 | PI-GPIO.5 12.06,33.66 27.94,33.66 v28.57,34.29 58.42,34.29 | U2.14 62.23,28.57 64.77,31.11 64.77,32.38 63.5,32.38 62.87,31.75 60.96,31.75 58.42,34.29 | U3.14 80.64,50.16 64.77,50.16 64.14,50.8 v59.05,50.8 56.52,53.34 56.52,57.15 v49.53,57.15 | v58.42,38.1 58.42,34.29
  Bottom 0.254: v28.57,34.29 v28.57,31.11 | 44.45,62.23 43.18,63.5 43.18,72.39 SERIAL_EXPANDER.6 | 44.45,62.23 v49.53,57.15 | 44.45,62.23 R12.1 | v58.42,38.1 59.05,38.73 v59.05,50.8
SDA  (via drill 0.61)
  Top 0.254: U1.15 31.11,29.84 27.94,33.02 | 27.94,33.02 13.97,33.02 PI-GPIO.3 | U2.15 57.78,29.84 58.42,30.48 58.42,31.11 | 58.42,31.11 58.42,33.02 27.94,33.02 | v39.37,63.5 41.91,66.04 v44.45,66.04 | U3.15 79.38,49.53 v64.14,49.53 | v63.5,31.11 58.42,31.11
  Bottom 0.254: v39.37,63.5 R11.1 | SERIAL_EXPANDER.5 v44.45,66.04 61.59,66.04 63.5,64.14 63.5,50.16 v64.14,49.53 64.14,31.75 v63.5,31.11
TX  (via drill 0.61)
  Top 0.254: PI-GPIO.8 6.35,30.48 6.35,22.86 v21.59,22.86
  Bottom 0.254: SERIAL_EXPANDER.7 45.72,72.39 45.72,74.93 38.73,74.93 38.1,74.3 38.1,66.67 29.21,66.67 R31.2 29.21,40.01 25.4,36.2 25.4,26.67 v21.59,22.86

### Text on the board
tNames: Raspberry PI I/O Expander / hobby-elektron.be / Sam Decoster / V0.1